# Altium schematic sheet scu_connector.SchDoc
size A
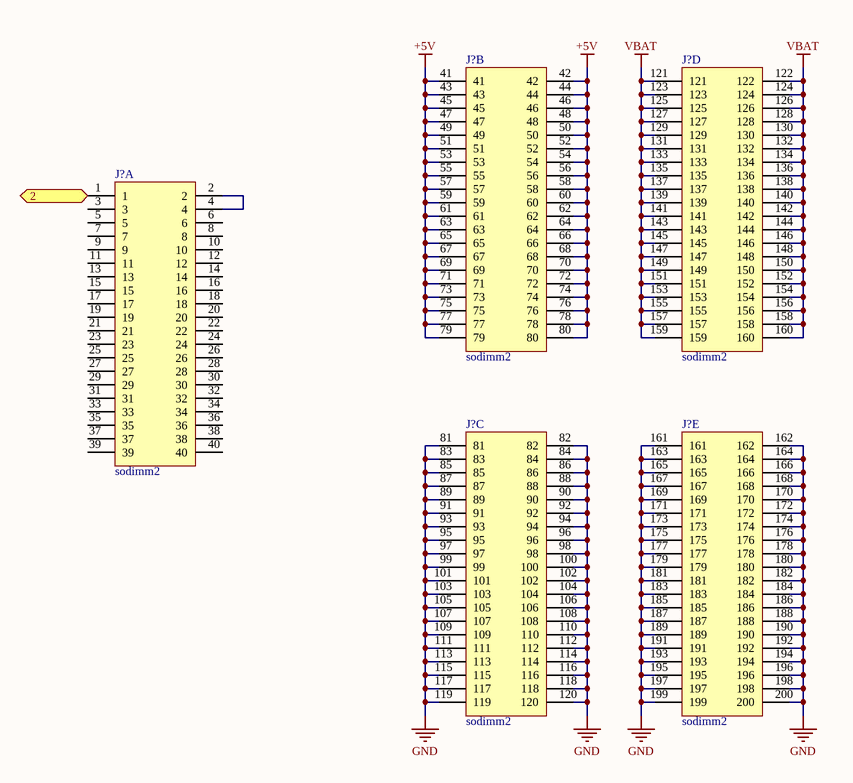
[diagram p0: scu_connector.SchDoc]

## Parts
(Parts that share a designator on the sheet are numbered #1, #2 ... from top to bottom, then left to right.)
J?#1  sodimm2  [SODIMM-DDR200]  (part B of 5)
J?#2  sodimm2  [SODIMM-DDR200]  (part D of 5)
J?#3  sodimm2  [SODIMM-DDR200]  (part C of 5)
J?#4  sodimm2  [SODIMM-DDR200]  (part E of 5)
J?#5  sodimm2  [SODIMM-DDR200]  (part A of 5)

## Ports
2

## Nets
+5V: J?#1.41 J?#1.42 J?#1.43 J?#1.44 J?#1.45 J?#1.46 J?#1.47 J?#1.48 J?#1.49 J?#1.50 J?#1.51 J?#1.52 J?#1.53 J?#1.54 J?#1.55 J?#1.56 J?#1.57 J?#1.58 J?#1.59 J?#1.60 J?#1.61 J?#1.62 J?#1.63 J?#1.64 J?#1.65 J?#1.66 J?#1.67 J?#1.68 J?#1.69 J?#1.70 J?#1.71 J?#1.72 J?#1.73 J?#1.74 J?#1.75 J?#1.76 J?#1.77 J?#1.78 J?#1.79 J?#1.80
GND: J?#3.81 J?#3.82 J?#3.83 J?#3.84 J?#3.85 J?#3.86 J?#3.87 J?#3.88 J?#3.89 J?#3.90 J?#3.91 J?#3.92 J?#3.93 J?#3.94 J?#3.95 J?#3.96 J?#3.97 J?#3.98 J?#3.99 J?#3.100 J?#3.101 J?#3.102 J?#3.103 J?#3.104 J?#3.105 J?#3.106 J?#3.107 J?#3.108 J?#3.109 J?#3.110 J?#3.111 J?#3.112 J?#3.113 J?#3.114 J?#3.115 J?#3.116 J?#3.117 J?#3.118 J?#3.119 J?#3.120 J?#4.161 J?#4.162 J?#4.163 J?#4.164 J?#4.165 J?#4.166 J?#4.167 J?#4.168 J?#4.169 J?#4.170 J?#4.171 J?#4.172 J?#4.173 J?#4.174 J?#4.175 J?#4.176 J?#4.177 J?#4.178 J?#4.179 J?#4.180 J?#4.181 J?#4.182 J?#4.183 J?#4.184 J?#4.185 J?#4.186 J?#4.187 J?#4.188 J?#4.189 J?#4.190 J?#4.191 J?#4.192 J?#4.193 J?#4.194 J?#4.195 J?#4.196 J?#4.197 J?#4.198 J?#4.199 J?#4.200
VBAT: J?#2.121 J?#2.122 J?#2.123 J?#2.124 J?#2.125 J?#2.126 J?#2.127 J?#2.128 J?#2.129 J?#2.130 J?#2.131 J?#2.132 J?#2.133 J?#2.134 J?#2.135 J?#2.136 J?#2.137 J?#2.138 J?#2.139 J?#2.140 J?#2.141 J?#2.142 J?#2.143 J?#2.144 J?#2.145 J?#2.146 J?#2.147 J?#2.148 J?#2.149 J?#2.150 J?#2.151 J?#2.152 J?#2.153 J?#2.154 J?#2.155 J?#2.156 J?#2.157 J?#2.158 J?#2.159 J?#2.160
2: J?#5.1 ; port 2
NetJ?#5_2: J?#5.2 J?#5.4

Not connected (* = marked no-connect by the designer): J?#5 3 5 6 7 8 9 10 11 12 13 14 15 16 17 18 19 20 21 22 23 24 25 26 27 28 29 30 31 32 33 34 35 36 37 38 39 40